# Altium schematic sheet sensor.SchDoc
size A
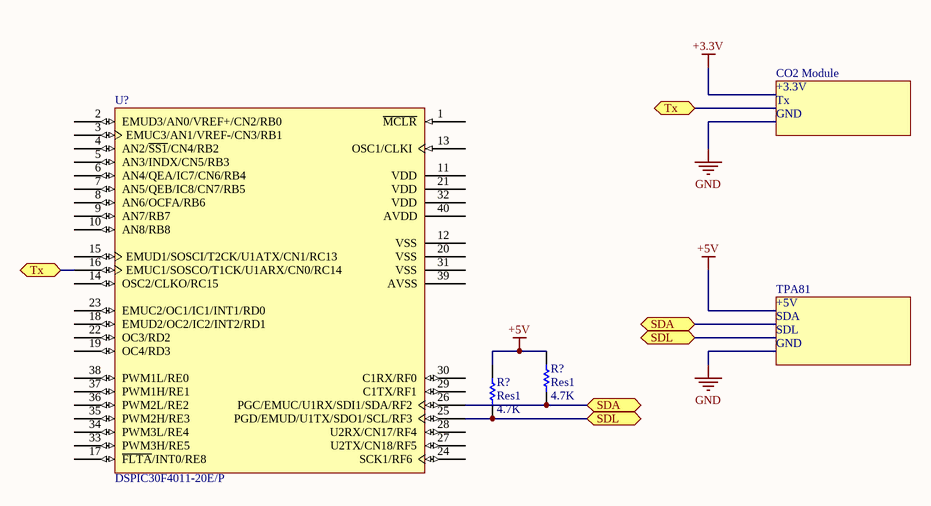
[diagram p0: sensor.SchDoc]

## Parts
(Parts that share a designator on the sheet are numbered #1, #2 ... from top to bottom, then left to right.)
R?#1  Res1  value 4.7K  [AXIAL-0.3]
R?#2  Res1  value 4.7K  [AXIAL-0.3]
U?  DSPIC30F4011-20E/P  [PDIP600-P40]

## Ports
SDA, SDL, Tx

## Nets
+5V: R?#1.2 R?#2.2
SDA: R?#1.1 U?.26(PGC/EMUC/U1RX/SDI1/SDA/RF2) ; port SDA
SDL: R?#2.1 U?.25(PGD/EMUD/U1TX/SDO1/SCL/RF3) ; port SDL
Tx: U?.16(EMUC1/SOSCO/T1CK/U1ARX/CN0/RC14) ; port Tx

Not connected (* = marked no-connect by the designer): U? 1(~{MCLR}) 2(EMUD3/AN0/VREF+/CN2/RB0) 3(EMUC3/AN1/VREF-/CN3/RB1) 4(AN2/~{SS1}/CN4/RB2) 5(AN3/INDX/CN5/RB3) 6(AN4/QEA/IC7/CN6/RB4) 7(AN5/QEB/IC8/CN7/RB5) 8(AN6/OCFA/RB6) 9(AN7/RB7) 10(AN8/RB8) 11(VDD) 12(VSS) 13(OSC1/CLKI) 14(OSC2/CLKO/RC15) 15(EMUD1/SOSCI/T2CK/U1ATX/CN1/RC13) 17(~{FLTA}/INT0/RE8) 18(EMUD2/OC2/IC2/INT2/RD1) 19(OC4/RD3) 20(VSS) 21(VDD) 22(OC3/RD2) 23(EMUC2/OC1/IC1/INT1/RD0) 24(SCK1/RF6) 27(U2TX/CN18/RF5) 28(U2RX/CN17/RF4) 29(C1TX/RF1) 30(C1RX/RF0) 31(VSS) 32(VDD) 33(PWM3H/RE5) 34(PWM3L/RE4) 35(PWM2H/RE3) 36(PWM2L/RE2) 37(PWM1H/RE1) 38(PWM1L/RE0) 39(AVSS) 40(AVDD)

## Notes on the sheet
- CO2 Module
- +3.3V
- Tx
- GND
- TPA81
- +5V
- SDA
- SDL

## Library data of the parts
R?#1 R?#2 = Res1: Resistor; Published: 8-Jun-2000; LatestRevisionDate: 17-Jul-2002; LatestRevisionNote: Re-released for DXP Platform.; PackageReference: AXIAL-0.3; Publisher: Altium Limited
U? = DSPIC30F4011-20E/P: High-Performance 16-bit Digital Signal Controller, 48 KB Flash, 2 KB SRAM, 1 KB EEPROM, 40-Pin PDIP, Extended High Temperature; FirstPublished: 29-Jan-2009; DatasheetVersion: revF, Jul-2008; PackageVersion: revBB, Aug-2009; PackageReference: PDIP600-P40; Publisher: Altium Limited; PackageDescription: 40-Lead Plastic Dual In-Line (P) - 600 mil Body [PDIP]; Supplier 1: Digi-Key; Supplier Part Number 1: DSPIC30F4011-20EP-ND; Supplier 2: Newark; Supplier Part Number 2: 56J7037; ComponentLink1Description: Datasheet; ComponentLink1URL: http://ww1.microchip.com/downloads/en/DeviceDoc/70135F.pdf; ComponentLink2Description: Packaging Specification; ComponentLink2URL: http://www.microchip.com/stellent/groups/techpub_sg/documents/packagingspec/en012702.pdf; ComponentLink3Description: Microchip.com Home; ComponentLink3URL: http://www.microchip.com/